# Altium schematic sheet power-v5v5n.SchDoc: Power -5.5V
size Letter; CheckedBy: J. Brinton; CompanyName: Signal Laboratories, Inc.; DrawnBy: J. Brinton; Engineer: J. Brinton; Address1: 3479 Edison Way; Address2: Menlo Park CA 94025; Address3: +1 (877) 778-8435; Address4: siglabs.com; Revision: 3; SheetNumber: 44; SheetTotal: 53
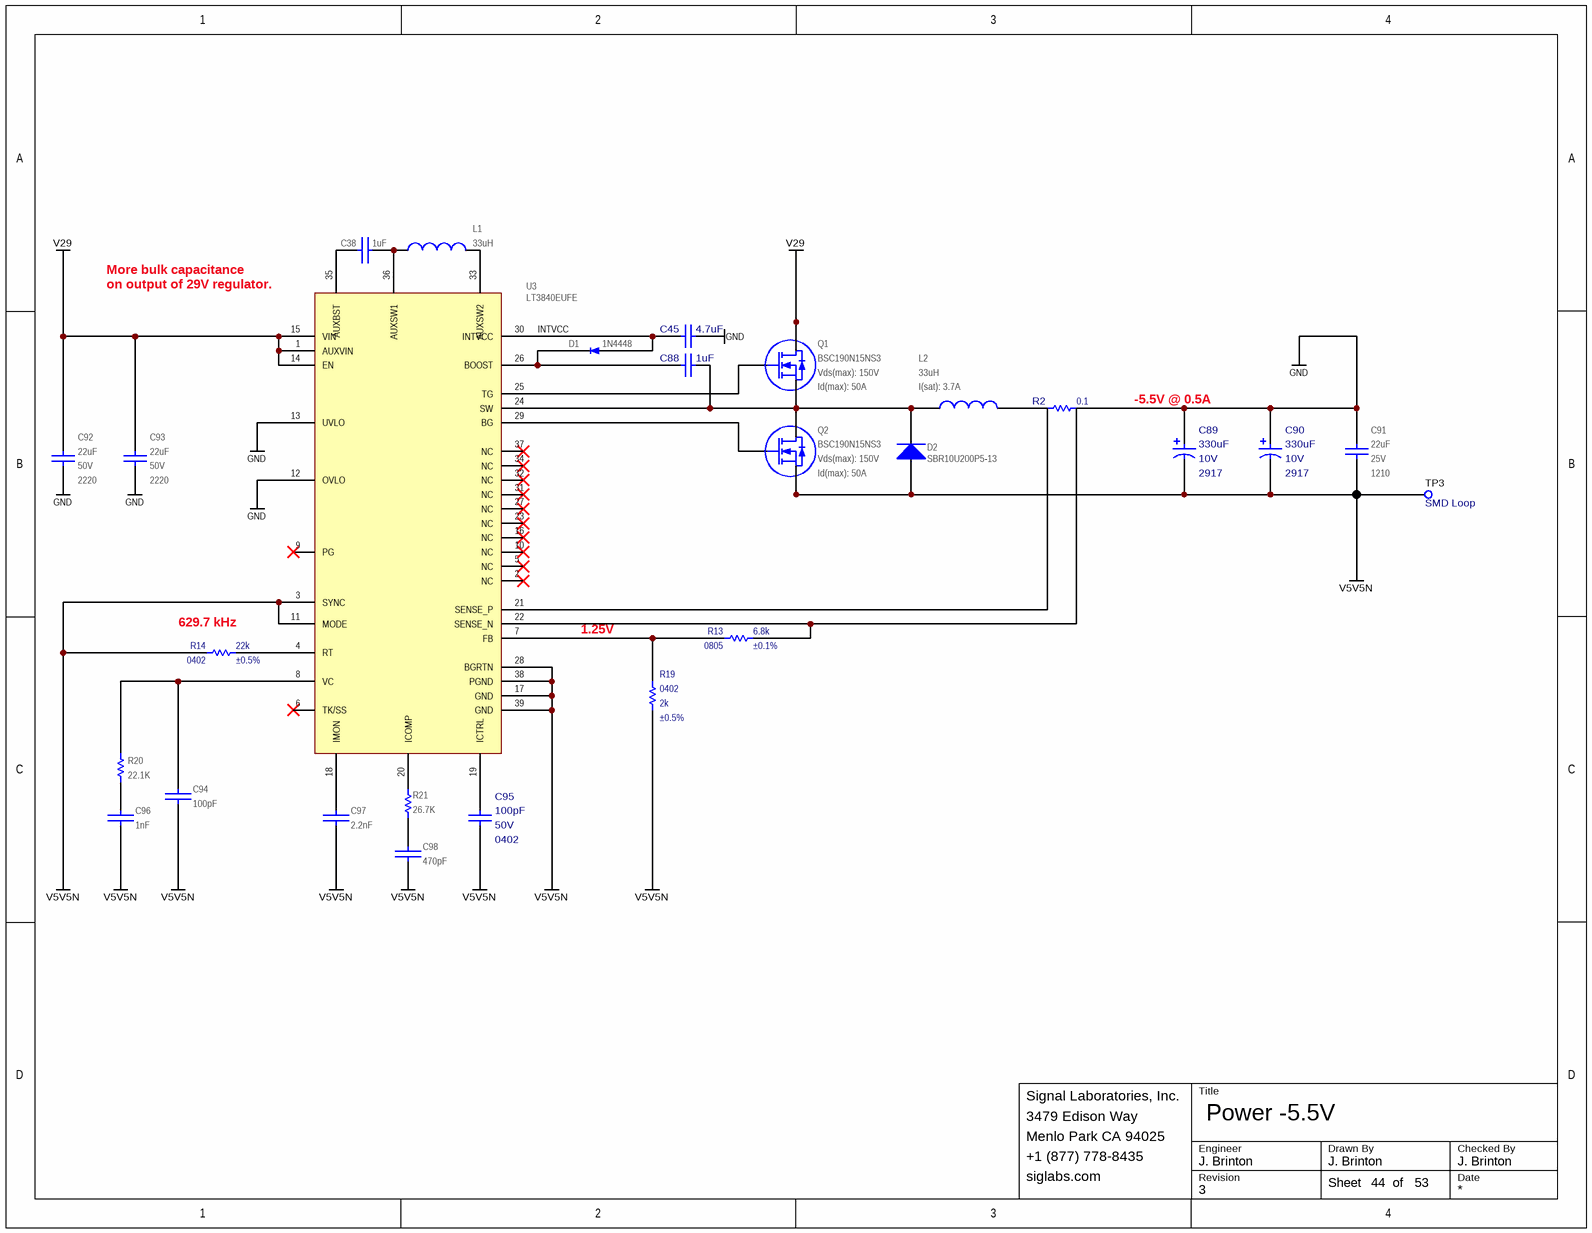
[diagram p0: power-v5v5n.SchDoc]

## Parts
C38  value 1uF  [CAPC100X50X55L25N]  (hidden comment: GRM155R61A105KE15)
C45  value 4.7uF  [CAPC160X80X90L20N]  (hidden comment: CL10A475KA8NQNC)
C88  value 1uF  [CAPC100X50X55L25N]  (hidden comment: GRM155R61A105KE15)
C89  value 330uF  Package: 2917  Voltage: 10V  [CAPPM730X435X310L135X240N]  (hidden comment: TPSE337K010R0050)
C90  value 330uF  Package: 2917  Voltage: 10V  [CAPPM730X435X310L135X240N]  (hidden comment: TPSE337K010R0050)
C91  value 22uF  Voltage: 25V  Package: 1210  [CAPC320X250X270L50N]  (hidden comment: GRM32ER71E226KE15)
C92  value 22uF  Voltage: 50V  Package: 2220  [CAPC600X500X500L160N]  (hidden comment: CKG57NX7S1H226M500JJ)
C93  value 22uF  Voltage: 50V  Package: 2220  [CAPC600X500X500L160N]  (hidden comment: CKG57NX7S1H226M500JJ)
C94  value 100pF  [CAPC100X50X55L25N]  (hidden comment: GRM1555C1H101JA01)
C95  value 100pF  Package: 0402  Voltage: 50V  [CAPC100X50X55L25N]  (hidden comment: VJ0402A101KXA)
C96  value 1nF  [CAPC100X50X55L25N]  (hidden comment: GRM1555C1H102JA01)
C97  value 2.2nF  [CAPC100X50X55L25N]  (hidden comment: C0402C222J3GACTU)
C98  value 470pF  [CAPC100X50X55L25N]  (hidden comment: GRM155R71H471JA01)
D1  Alternative P/N: 1N4448  [SOD323]  (hidden comment: 1N4448HWS-7-F)
D2  SBR10U200P5-13  [DIODES_POWERDI5]
L1  value 33uH  [ME3220]  (hidden comment: ME3220-333KL)
L2  value 33uH  I(sat): 3.7A  [XAL6060]  (hidden comment: XAL6060-333ME)
Q1  BSC190N15NS3  Vds(max): 150V  Id(max): 50A  [TDSON-8]
Q2  BSC190N15NS3  Vds(max): 150V  Id(max): 50A  [TDSON-8]
R2  value 0.1  [KRL3216T4]  (hidden comment: KRL3216T4A-M-R100-F)
R13  value 6.8k  Tolerance: ±0.1%  Package: 0805  [RESC2012X70N]  (hidden comment: RG2012P-682-B-T5)
R14  value 22k  Tolerance: ±0.5%  Package: 0402  [RESC1005X40N]  (hidden comment: RR0510P-223-D)
R19  value 2k  Tolerance: ±0.5%  Package: 0402  [RESC1005X40N]  (hidden comment: RR0510P-202-D)
R20  value 22.1K  [RESC1005X40N]  (hidden comment: ERJ-2RKF2212X)
R21  value 26.7K  [RESC1005X40N]  (hidden comment: ERJ-2RKF2672X)
TP3  Notes: SMD Loop  [5015]  (hidden comment: 5015)
U3  LT3840EUFE  [QFN39P40_600X400X80L40X20T465X265N]

## Nets
GND: C45.2 C89.1 C90.1 C91.2 C92.1 C93.1 R2.1 U3.12(OVLO) U3.13(UVLO)
V5V5N: C89.2 C90.2 C91.1 C94.1 C95.2 C96.2 C97.2 C98.1 D2.A Q2.1(S) Q2.2(S) Q2.3(S) R14.2 R19.1 TP3.1 U3.3(SYNC) U3.11(MODE) U3.17(GND) U3.28(BGRTN) U3.38(PGND) U3.39(GND)
V29: C92.2 C93.2 Q1.5(D) Q1.6(D) Q1.7(D) Q1.8(D) Q1.9(D) U3.1(AUXVIN) U3.14(EN) U3.15(VIN)
INTVCC: C45.1 D1.A U3.30(INTVCC)
NetC38_1: C38.1 L1.1 U3.36(AUXSW1)
NetC38_2: C38.2 U3.35(AUXBST)
NetC88_1: C88.1 D1.K U3.26(BOOST)
NetC88_2: C88.2 D2.K L2.1 Q1.1(S) Q1.2(S) Q1.3(S) Q2.5(D) Q2.6(D) Q2.7(D) Q2.8(D) Q2.9(D) U3.24(SW)
NetC94_2: C94.2 R20.2 U3.8(VC)
NetC95_1: C95.1 U3.19(ICTRL)
NetC96_1: C96.1 R20.1
NetC97_1: C97.1 U3.18(IMON)
NetC98_2: C98.2 R21.2
NetL1_2: L1.2 U3.33(AUXSW2)
NetL2_2: L2.2 R2.2
NetQ1_4: Q1.4(G) U3.25(TG)
NetQ2_4: Q2.4(G) U3.29(BG)
NetR2_3: R2.3 R13.1 U3.22(SENSE_N)
NetR2_4: R2.4 U3.21(SENSE_P)
NetR13_2: R13.2 R19.2 U3.7(FB)
NetR14_1: R14.1 U3.4(RT)
NetR21_1: R21.1 U3.20(ICOMP)

Not connected (* = marked no-connect by the designer): U3 2(NC)* 5(NC)* 6(TK/SS)* 9(PG)* 10(NC)* 16(NC)* 23(NC)* 27(NC)* 31(NC)* 32(NC)* 34(NC)* 37(NC)*

## Notes on the sheet
- More bulk capacitance
- (near U3) on output of 29V regulator.
- -5.5V @ 0.5A
- (near R14) 629.7 kHz
- 1.25V
- Title
- Engineer
- Revision
- Drawn By
- Checked By
- Date
- Sheet
- of

## Library data of the parts
C38 = CAP: Ceramic Capacitor 1uF ±10% 10V X5R 0402; Manufacturer: Murata; Tr: -55:125; Manufacturer P/N: GRM155R61A105KE15; Package: 0402; Tolerance: ±10%; Voltage: 10V
C45 = TMK212B7475KG: Ceramic Capacitor 4.7uF ±10% 25V X5R 0603; Manufacturer: Samsung; Tr: -55:85; Manufacturer P/N: CL10A475KA8NQNC; Tolerance: ±10%; Package: 0603; Voltage: 25V
C88 = UMK212B7105KG: Ceramic Capacitor 1uF ±10% 10V X5R 0402; Manufacturer: Murata; Voltage: 50V; Manufacturer P/N: GRM155R61A105KE15; Tolerance: ±10%; Tr: *; Package: 0402
C89 C90 = CAP_POL: Tantalum Capacitor 330uF ±10% 10V 2917; Manufacturer: AVX; Tr: -55:125; Manufacturer P/N: TPSE337K010R0050; Tolerance: ±10%
C91 = CAP: Ceramic Capacitor 22uF ±10% 25V X7R 1210; Manufacturer: Murata; Tr: -55:125; Manufacturer P/N: GRM32ER71E226KE15; Tolerance: ±10%
C92 C93 = CAP: Ceramic Capacitor 22uF ±20% 50V X7S Stacked; Manufacturer: TDK; Tr: -55:125; Manufacturer P/N: CKG57NX7S1H226M500JJ; Tolerance: ±20%
C94 = CAP: Ceramic Capacitor 100pF ±5% 50V NP0 0402; Manufacturer: Murata; Tr: -55:125; Manufacturer P/N: GRM1555C1H101JA01; Voltage: 50V; Package: 0402; Tolerance: ±5%
C95 = VJ0402A101KXA: Ceramic Capacitor 100pF ±10% 50V C0G 0402; Manufacturer: Vishay; Tr: -55:150; Manufacturer P/N: VJ0402A101KXA; Tolerance: ±10%
C96 = CAP: Ceramic Capacitor 1nF ±5% 50V NP0 0402; Manufacturer: Murata; Tr: -55:125; Manufacturer P/N: GRM1555C1H102JA01; Voltage: 50V; Package: 0402; Tolerance: ±5%
C97 = CAP: Ceramic Capacitor 2.2nF ±5% 25V NP0 0402; Manufacturer: Kemet; Tr: -55:125; Manufacturer P/N: C0402C222J3GACTU; Package: 0402; Tolerance: ±5%; Voltage: 25V
C98 = CAP: Ceramic Capacitor 470pF ±5% 50V X7R 0402; Manufacturer: Murata; Tr: -55:125; Manufacturer P/N: GRM155R71H471JA01; Voltage: 50V; Package: 0402; Tolerance: ±5%
D1 = 1N4448HWS-7-F: Schottky Diode 80V 250mA SOD323; Manufacturer: Diodes Inc; Manufacturer P/N: 1N4448HWS-7-F; Package: SOD323
D2 = PDS5100H: Schottky Diode 200V 10A SMD; Manufacturer: Diodes Inc; Manufacturer P/N: SBR10U200P5-13; Current: 10A; Reverse Voltage (max): 200V; Package: PowerDi-5
L1 = COIL: Inductor 33uH ±10% 500mA SMD; Manufacturer: Coilcraft; Tr: -40:85; Manufacturer P/N: ME3220-333KL; I(sat): 500mA; Package: *; Tolerance: ±10%
L2 = COIL: Inductor 33uH,3.7A(sat), SMD; Manufacturer: Coilcraft; Manufacturer P/N: XAL6060-333ME
Q1 Q2 = BSC190N15NS3: MOSFET N-Channel Enhancement Mode; Manufacturer: Infineon; Rds(on): 19mOhm; Manufacturer P/N: BSC190N15NS3
R2 = KRL3216T4A-M-R009-F: Current Sense Resistor 100 mOhms +/-1% SMD 4-Terminal; Manufacturer: Susumu; Tolerance: ±1%; Tr: -55:+155; Manufacturer P/N: KRL3216T4A-M-R100-F
R13 = RES: Thin Film Resistor 6.8k +/-0.1% SMD 0805; Manufacturer: Susumu; Tr: -55:155; Tcr: *; Manufacturer P/N: RG2012P-682-B-T5; Alternatives: *; Voltage: *; Power: *
R14 = RES: Thin Film Resistor 22k +/-0.5% SMD 0402; Manufacturer: Susumu; Tr: -55:155; Tcr: *; Manufacturer P/N: RR0510P-223-D; Alternatives: *; Voltage: *; Power: *
R19 = RES: Thin Film Resistor 2k +/-0.5% SMD 0402; Manufacturer: Susumu; Tr: -55:155; Tcr: *; Manufacturer P/N: RR0510P-202-D; Alternatives: *; Voltage: *; Power: *
R20 = RES 0402: Thick Film Resistor 22.1k ±1% 0402; Manufacturer: Panasonic; Tr: -55:155; Package: 0402; Manufacturer P/N: ERJ-2RKF2212X; Tolerance: ±1%
R21 = RES 0402: Thick Film Resistor 26.7k ±1% 0402; Manufacturer: Panasonic; Tr: -55:155; Package: 0402; Manufacturer P/N: ERJ-2RKF2672X; Tolerance: ±1%
TP3 = TEST_POINT_SMD_50: Test Point SMD; Manufacturer: Keystone; Manufacturer P/N: 5015
U3 = LT3840EUFE: Synchronous Regulator Controller; Manufacturer: Linear Technology; Alternative P/N: LT3840IUFE; Manufacturer P/N: LT3840EUFE